# Altium project MediBox.PrjPcb
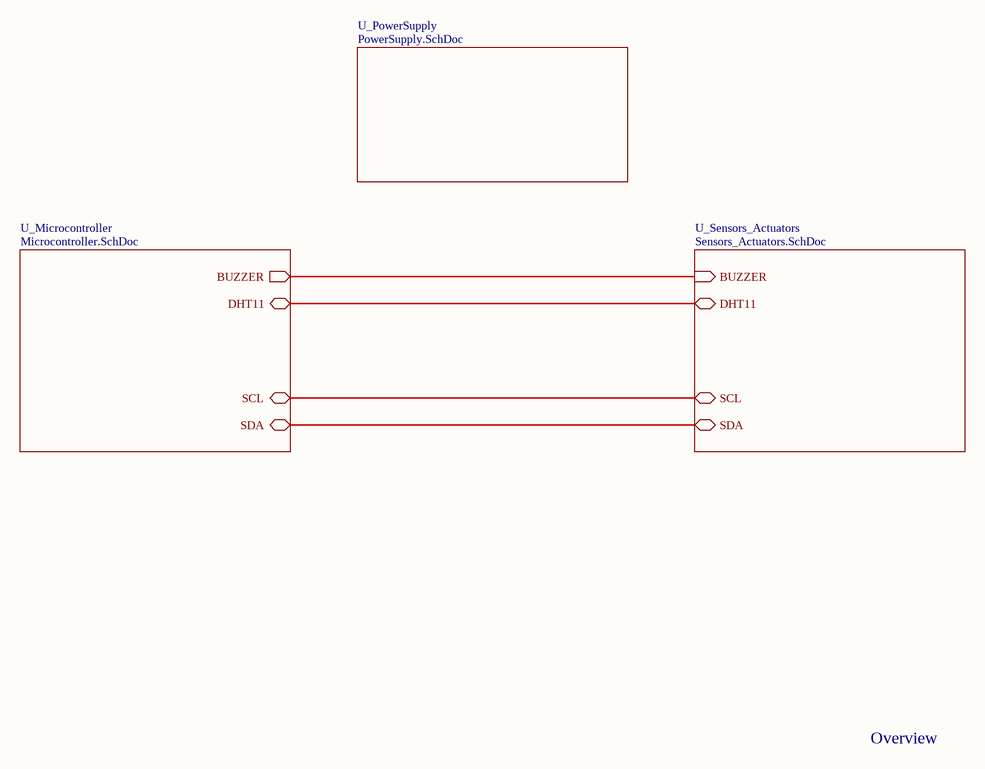
[diagram p0: Overview.SchDoc]
4 sheets, 36 parts. Net scope: hierarchical (ports join the sheet entries above them; power ports are global).
Board file: PCB1.PcbDoc
Sheets:
  Overview.SchDoc
    U_Microcontroller = Microcontroller.SchDoc
    U_PowerSupply = PowerSupply.SchDoc
    U_Sensors_Actuators = Sensors_Actuators.SchDoc

## Sheet Overview.SchDoc
size A4; SheetNumber: 1; SheetTotal: 4

### Sub-sheets
U_Microcontroller = Microcontroller.SchDoc: DHT11 (bidir), BUZZER (out), SDA (bidir), SCL (bidir)
U_PowerSupply = PowerSupply.SchDoc: no entries
U_Sensors_Actuators = Sensors_Actuators.SchDoc: SDA (bidir), DHT11 (bidir), SCL (bidir), BUZZER (in)

### Nets
NetMD1_14: sheet U_Microcontroller/DHT11, sheet U_Sensors_Actuators/DHT11
NetMD1_16: sheet U_Microcontroller/BUZZER, sheet U_Sensors_Actuators/BUZZER
NetMD1_33: sheet U_Microcontroller/SDA, sheet U_Sensors_Actuators/SDA
NetMD1_36: sheet U_Microcontroller/SCL, sheet U_Sensors_Actuators/SCL

### Notes on the sheet
- Overview

## Sheet Microcontroller.SchDoc
size A4; SheetNumber: 3; SheetTotal: 4
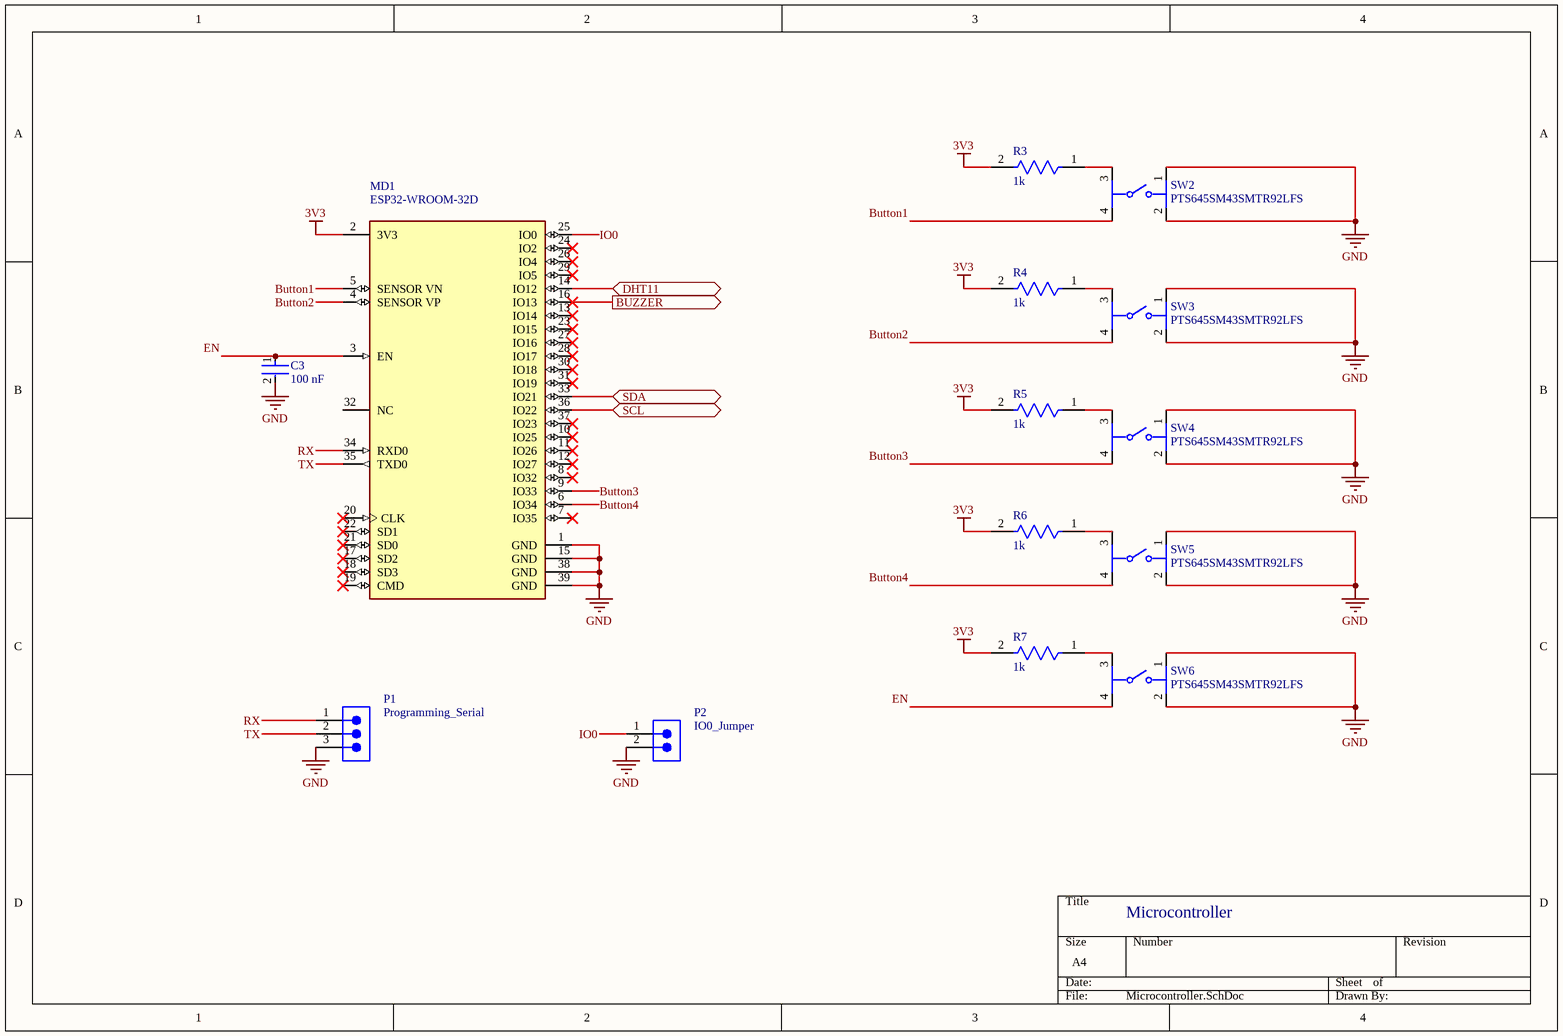
[diagram p1: Microcontroller.SchDoc]

### Parts
C3  100 nF  [FP-CC1206-1_25-MFG]
MD1  ESP32-WROOM-32D  [FP-ESP32-WROOM-32D-MFG]
P1  Programming_Serial  [61900311121]
P2  IO0_Jumper  [61300211121]
R3  1k  [FP-CRCW1206-e3-MFG]
R4  1k  [FP-CRCW1206-e3-MFG]
R5  1k  [FP-CRCW1206-e3-MFG]
R6  1k  [FP-CRCW1206-e3-MFG]
R7  1k  [FP-CRCW1206-e3-MFG]
SW2  PTS645SM43SMTR92LFS  [FP-PTS645SM43SMTR92LFS-MFG]
SW3  PTS645SM43SMTR92LFS  [FP-PTS645SM43SMTR92LFS-MFG]
SW4  PTS645SM43SMTR92LFS  [FP-PTS645SM43SMTR92LFS-MFG]
SW5  PTS645SM43SMTR92LFS  [FP-PTS645SM43SMTR92LFS-MFG]
SW6  PTS645SM43SMTR92LFS  [FP-PTS645SM43SMTR92LFS-MFG]

### Ports
BUZZER (out, see Sensors_Actuators[3B]), DHT11 (bidir, see Sensors_Actuators[1C]), SCL (bidir, see Sensors_Actuators[1B]), SDA (bidir, see Sensors_Actuators[1A])

### Nets
3V3: MD1.2(3V3) R3.2 R4.2 R5.2 R6.2 R7.2
GND: C3.2 MD1.1(GND) MD1.15(GND) MD1.38(GND) MD1.39(GND) P1.3 P2.2 SW2.1 SW2.2 SW3.1 SW3.2 SW4.1 SW4.2 SW5.1 SW5.2 SW6.1 SW6.2
Button1: MD1.5(SENSOR_VN) SW2.4
Button2: MD1.4(SENSOR_VP) SW3.4
Button3: MD1.9(IO33) SW4.4
Button4: MD1.6(IO34) SW5.4
EN: C3.1 MD1.3(EN) SW6.4
IO0: MD1.25(IO0) P2.1
RX: MD1.34(RXD0) P1.1
TX: MD1.35(TXD0) P1.2
NetMD1_14: MD1.14(IO12) ; port DHT11
NetMD1_16: MD1.16(IO13) ; port BUZZER
NetMD1_33: MD1.33(IO21) ; port SDA
NetMD1_36: MD1.36(IO22) ; port SCL
NetR3_1: R3.1 SW2.3
NetR4_1: R4.1 SW3.3
NetR5_1: R5.1 SW4.3
NetR6_1: R6.1 SW5.3
NetR7_1: R7.1 SW6.3

Not connected (* = marked no-connect by the designer): MD1 7(IO35)* 8(IO32)* 10(IO25)* 11(IO26)* 12(IO27)* 13(IO14)* 17(SD2)* 18(SD3)* 19(CMD)* 20(CLK)* 21(SD0)* 22(SD1)* 23(IO15)* 24(IO2)* 26(IO4)* 27(IO16)* 28(IO17)* 29(IO5)* 30(IO18)* 31(IO19)* 32(NC) 37(IO23)*

### Notes on the sheet
- Microcontroller

### Library data of the parts
C3 = CMP-03422-000842-1: CAP CER 0.1UF 50V X7R 1206; Manufacturer: Yageo; Manufacturer Part Number: CC1206KRX7R9BB104; Automotive Grade: NA; Tolerance: 0.1; Material: Ceramic; Temperature Coefficient: 15%; Temperature Characteristic: X7R; Device Class L1: Passive Components; Lead Free: Yes; Octopart: https://octopart.com/cc1206krx7r9bb104-yageo-39467816; Category: Cap; Value: 100 nF; Temperature Range Low: -55°C; Device Class L3: Ceramic Capacitors; Voltage Rating: 50 V; Temperature Range High: +125°C; Device Class L2: Capacitors; RoHS: TRUE; Package: CC1206-1.25; Footprint Url: http://www.yageo.com/exep/pages/download/literatures/UPY-C_GEN_24.pdf; ComponentLink2Description: Datasheet; Temperature: -55°C to +125°C; Capacitance: 100 nF; Digikey Description: CAP CER 0.1UF 50V X7R 1206; Height: 1.45mm; Automotive: No; Mouser Description: Multilayer Ceramic Capacitors MLCC - SMD/SMT 100nF 50V X7R 10%; ComponentLink2URL: http://www.yageo.com/documents/recent/UPY-NP0X7R_HV_1KV-to-3KV_11.pdf
MD1 = CMP-194065-000003-1: WIFI MODULE 32MBITS SPI FLASH; Manufacturer: Espressif Systems; Max Supply Voltage: 3.6V; Nominal Supply Current: 500mA; Max Frequency: 2484MHz; Number Of Adc Channels: 16; Number Of Gpio: 32; Interface: I2C,SPI,UART,Ethernet,I2S,Other; Data Rate: 150Mbits/s; Min Supply Voltage: 3V; Bandwidth: 72MHz; Sensitivity: -98dBm; Octopart: https://octopart.com/esp32-wroom-32d-espressif+systems-91040050; Package: ESP32-WROOM-32D; ComponentLink2URL: https://www.espressif.com/sites/default/files/documentation/esp32-wroom-32d_esp32-wroom-32u_datasheet_en.pdf; Lead Free: Yes; Category: UNK; Mouser Description: Wi-Fi/BT BLE Module ESP32-D0WD, SPI Flash, UART, P; Device Class L1: Integrated Circuits (ICs); RoHS: TRUE; Temperature Range Low: -40°C; ComponentLink2Description: Datasheet; Digikey Description: WIFI MODULE 32MBITS SPI FLASH; Height: 3.2mm; Temperature: -40°C to +85°C; Manufacturer Part Number: ESP32-WROOM-32D; Device Class L3: Transceivers; Device Class L2: RF Semiconductors and Devices; Temperature Range High: +85°C; Automotive: No
P1 = CMP-1502-00585-2: NexarPartId: 18818222; Current Rating: 3A; Voltage Rating: 250V; Number of Positions: 3; Insulation Resistance: 1GΩ; Gender: Male; Pitch: 2.54mm; Connector Type: Male Pin; Contact Resistance: 20mΩ; Termination: Through Hole; Width: 7.66mm; Contact Plating: Tin; Orientation: Vertical; Mount: Through Hole; Contact Gender: Male; Max Operating Temperature: 105°C; Length: 7.62mm; Number of Rows: 1; Height: 12.5mm; Lead Pitch: 2.54mm; Housing Material: Nylon; Color: Beige; Contact Material: Copper; Fastening Type: Friction; Min Operating Temperature: -40°C; Number of Contacts: 3; Number of Pins: 3; Flammability Rating: UL94 V-0; Contact Mating Length: 7.493mm; RoHS: Compliant; REACH SVHC: Unknown; Packaging: Bulk; Operating Supply Voltage: 250V
P2 = CMP-1712-00002-6: NexarPartId: 20081794; Number of Contacts: 2; Pitch: 2.54mm; Connector Type: Male Pin; Voltage Rating: 250V; Current Rating: 3A; Gender: Male; Contact Resistance: 20mΩ; Height: 8.94mm; Lead Free: Lead Free; Number of Pins: 2; Termination: Through Hole; RoHS: Compliant; Lead Pitch: 2.54mm; REACH SVHC: No SVHC; Housing Material: PBT; Contact Mating Length: 5.9944mm; Min Operating Temperature: -40°C; Orientation: Vertical; Contact Material: Copper; Contact Gender: Male; Max Operating Temperature: 125°C; Number of Rows: 1; Number of Positions: 2; Packaging: Bulk; Contact Plating: Gold; Mount: Through Hole; Color: Black; Operating Supply Voltage: 250V
R3-R7 = CMP-2003-01876-2: RES Thick Film, 1.2kΩ, 1%, 0.25W, 100ppm/°C, 1206; Voltage Rating (DC): 200V; Power Rating: 250mW; Resistance: 1.2kR; Temperature Coefficient: 100ppm/°C; Features: Automotive AEC-Q200; Lead Free: Lead Free; Termination: SMD/SMT; Composition: Thick Film; Length: 3.2mm; Width: 0.063inch; Case Code (Imperial): 1206; Contact Plating: Tin; Number of Terminations: 2; Height: 0.55mm; Depth: 1.6mm; Max Operating Temperature: 155°C; Tolerance: 1%; Case/Package: 1206; Voltage Rating: 200V; Case Code (Metric): 3216; Packaging: Tape and Reel; Weight: 0.000353oz; Package Quantity: 10; Max Power Dissipation: 250mW; Min Operating Temperature: -55°C; Working Voltage: 200V; Radiation Hardening: No; Military Standard: Not
SW2-SW6 = CMP-2000-05160-2: SWITCH TACTILE SPST-NO 0.05A 12V; Contact Resistance: 100mR; Throw Configuration: SPST; Illumination Type: Non-Illuminated; Mechanical Life: 100000Cycles; Current Rating: 50mA; Switch Function: Off-Mom; Actuator Length: 0.85mm; Actuator Material: Nylon; Actuator Type: Standard; Operating Force: 160gf; Min Operating Temperature: -20°C; REACH SVHC: No SVHC; Termination: Gull Wing; Case/Package: SMD/SMT; Packaging: Tape and Reel; Mount: Surface Mount; Voltage Rating (DC): 12V; Orientation: Straight; Lead Free: Lead Free; Contact Material: Silver; Color: Black; Max Current Rating: 50mA; Contact Plating: Silver; Depth: 9mm; Package Quantity: 1; Max Voltage Rating (DC): 12V; Length: 6mm; Max Operating Temperature: 60°C

## Sheet PowerSupply.SchDoc
size A4; SheetNumber: 2; SheetTotal: 4
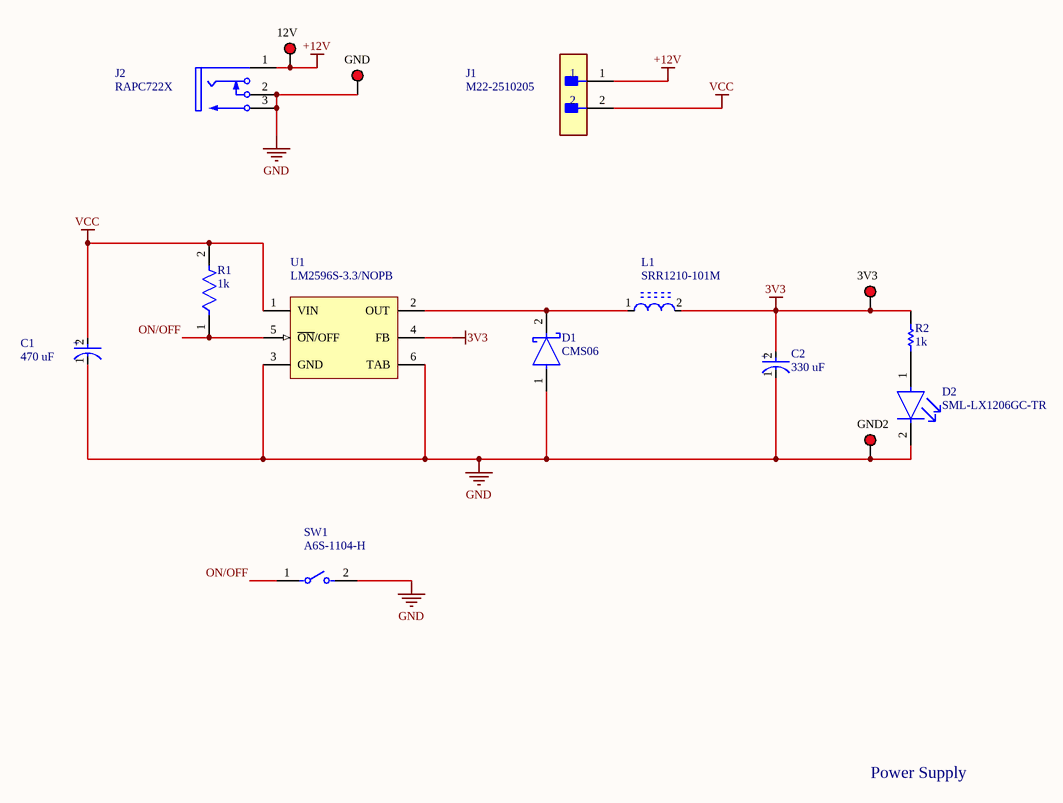
[diagram p2: PowerSupply.SchDoc]

### Parts
3V3  5010  [KSTN-5010_V]  (value not drawn)
12V  5010  [KSTN-5010_V]  (value not drawn)
C1  470 uF  [FP-FKF-MFG]
C2  330 uF  [FP-FKG-MFG]
D1  CMS06  [FP-M-FLAT-MFG]
D2  SML-LX1206GC-TR  [FP-SML-LX1206GC-TR-MFG]
GND  5010  [KSTN-5010_V]  (value not drawn)
GND2  5010  [KSTN-5010_V]  (value not drawn)
J1  M22-2510205  [FP-M22-2510205-MFG]
J2  RAPC722X  [SWITCH-RAPC712X-3_V]
L1  SRR1210-101M  [FP-SRR1210-MFG]
R1  1k  [FP-CRCW1206-e3-MFG]
R2  1k  [RESC3216X70X50ML20T25]
SW1  A6S-1104-H  [FP-A6S-1104-H-MFG]
U1  LM2596S-3.3/NOPB  [KTT0005B_M]

### Nets
3V3: 3V3.1 C2.2(A) L1.2 R2.2 U1.4(FB)
+12V: 12V.1 J1.1 J2.1
GND: C1.1(C) C2.1(C) D1.1(A) D2.2(C) GND.1 GND2.1 J2.2 J2.3 SW1.2 U1.3(GND) U1.6(TAB)
VCC: C1.2(A) J1.2 R1.2 U1.1(VIN)
ON/OFF: R1.1 SW1.1 U1.5(~{ON}/OFF)
NetD1_2: D1.2(C) L1.1 U1.2(OUT)
NetD2_1: D2.1(A) R2.1

### Notes on the sheet
- Power Supply
- (in symbol CMP-2000-06208-3) +
- (in symbol CMP-05427-002115-1) +

### Library data of the parts
3V3 12V GND GND2 = CMP-1672-00002-4: Test Point, Red, Through Hole, RoHS, Bulk; Manufacturer: Keystone; Contact Material: Bronze; Mounting Technology: Through Hole; RoHSCompliant: true; Pins: 1; Package Quantity: 100; ComponentLink2Description: Datasheet; Height: 8.12 mm; ComponentLink1URL: http://www.keyelco.com/; DatasheetVersion: Rev. F, 12/2013; Mount: Through Hole; PackageReference: 5010; Contact Plating: Silver; Packaging: Bulk; Colour: Red; REACH SVHC: No SVHC; PackageDescription: 1-Pin Through Hole Device, Dia 3.17 mm; ComponentLink2URL: http://www.keyelco.com/product-pdf.cfm?p=1319; ComponentLink1Description: Manufacturer URL
C1 = CMP-2000-06208-3: CAP ALUM 100UF 20% 50V SMD; Leakage Current: 3uA; ESR (Equivalent Series Resistance): 340mR; Material: Aluminium; Ripple Current: 350mA; Life (Hours): 2000Hour; Min Operating Temperature: -55°C; Contact Plating: Tin; REACH SVHC: No SVHC; RoHS Compliant: Yes; Width: 10mm; Radiation Hardening: No; Termination: SMD/SMT; Packaging: Tape and Reel; Max Operating Temperature: 105°C; Case/Package: Radial; Voltage Rating: 50V; Length: 10.2mm; Voltage: 50V; Package Quantity: 1; Voltage Rating (DC): 50V; Height - Seated (Max): 0.402inch; Mount: Surface Mount; Impedance: 340mR; Construction: Cylindrical; Height: 10.2mm; Lead Free: Lead Free; Dielectric Material: Aluminium; Series: FK; Tolerance: 20%; Diameter: 8mm; Ripple Current (AC): 350mA; Capacitance: 100uF; Number of Pins: 2
C2 = CMP-05427-002115-1: CAP ALUM 330UF 20% 35V SMD; ESR (Equivalent Series Resistance): 80mR; Ripple Current: 850mA; Dielectric Material: Aluminium; Lead Length: 3.5mm; Life (Hours): 2000Hour; Leakage Current: 115.5uA; Length: 10.2mm; Construction: Cylindrical; Package Quantity: 500; Termination: SMD/SMT; RoHS Compliant: Yes; Impedance: 80mR; Width: 10.3mm; Height - Seated (Max): 0.402inch; Voltage: 35V; Voltage Rating: 35V; Diameter: 10mm; Contact Plating: Tin; Number of Pins: 2; Capacitance: 330uF; Case/Package: Radial; Reach SVHC Compliant: Yes; Lead Free: Lead Free; Series: FK; Ripple Current (AC): 850mA; Tolerance: 20%; Ratings: AEC-Q200; Lead Pitch: 4.6mm; Mount: Surface Mount; Height: 10.2mm; Max Operating Temperature: 105°C; Packaging: Tape and Reel; Min Operating Temperature: -55°C; Voltage Rating (DC): 35V; Radiation Hardening: No
D1 = CMP-2000-06115-2: DIODE SCHOTTKY 30V 2A MFLAT; Forward Voltage: 370mV; Peak Non-Repetitive Surge Current: 40A; Max Reverse Leakage Current: 3mA; Element Configuration: Single; Package Quantity: 1; Max Operating Temperature: 125°C; Mount: Surface Mount; Max Repetitive Reverse Voltage (Vrrm): 30V; Forward Current: 2A; Number of Pins: 2; Min Operating Temperature: -40°C; Radiation Hardening: No; Average Rectified Current: 2A; Contact Plating: Tin; Max Reverse Voltage (DC): 30V; Peak Reverse Current: 3mA; Max Surge Current: 40A; Packaging: Tape and Reel
D2 = CMP-2000-07122-2: LED GREEN CLEAR 1206 SMD; Test Current: 20mA; Luminous Intensity: 10mcd; Forward Voltage: 2.2V; Viewing Angle: 160°; Lens Color: Colorless; Approvals: UL; Dominant Wavelength: 565nm; Current Rating: 25mA; Number of LEDs: 1; Power Rating: 65mW; Lens Style: Rectangular; Length: 3.2mm; Mount: Surface Mount; Package Quantity: 1; Forward Current: 20mA; Case/Package: 1206; Lead Free: Lead Free; Case Code (Imperial): 1206; Max Operating Temperature: 85°C; REACH SVHC: No SVHC; RoHS Compliant: Yes; Number of Pins: 2; Illumination Color: Green; Width: 1.6mm; Packaging: Tape and Reel; Wavelength: 565nm; Lens Transparency: Clear; Height: 1.1mm; Color: Green; Min Operating Temperature: -40°C; Case Code (Metric): 3216
J1 = CMP-15831-000005-1: CONN HEADER VERT 2POS 2MM; Manufacturer: Harwin; Conn Gender: Male; Current Rating: 2A; Number Of Contacts: 2; Conn Orientation: Vertical; Temperature Range Low: -40°C; Device Class L1: Connectors; ComponentLink2URL: https://cdn.harwin.com/pdfs/C018XX_M22_Series_Connectors.pdf; Temperature Range High: +105°C; Pitch: 2mm; Number Of Rows: 1; Temperature: -40°C to +105°C; Automotive: No; Device Class L3: unset; Octopart: https://octopart.com/m22-2510205-harwin-2538221; Mouser Description: Headers & Wire Housings 2 PIN SIL VERTICAL GOLD PIN HEADER; Height: 5.45mm; Category: Conn; Digikey Description: CONN HEADER VERT 2POS 2MM; Contact Material: Gold,Nickel; Lead Free: Yes; ComponentLink2Description: Datasheet; Manufacturer Part Number: M22-2510205; Device Class L2: Headers and Wire Housings; Package: 0; Footprint Url: https://cdn.harwin.com/pdfs/M22-251.pdf; RoHS: TRUE
J2 = CMP-2000-05384-1: Power Jack, 5 A, 3-Pin THD, RoHS, Bulk; Manufacturer: Switchcraft; Current Rating: 5A; Plug/Mating Plug Diameter: 2.1mmID,5.5mmOD; Gender: Male; Mating Products: S765-ND / -CONNPLUGMINIPWR2CONDWHT/RED / S760K-ND / -CONNPOWERPLUGMINI.08"BLACK / SC1052-ND / -CONNPOWERPLUGMINIBLACK; Number of Positions/Contacts: 2Conductors,2Contacts; Internal Switch(s): SingleSwitch,NormallyClosed; Shielding: Unshielded; Catalog Drawings: RAPC7(1,2)2XSide / RAPC7(1,2)2XTop; Dynamic Catalog: SwitchcraftInc; Other Names: Q2287470A / RAPC722X-ND / SC1313; Standard Package: 2,500; Termination: SolderEyelet(s); Family: Barrel-PowerConnectors; Housing Color: Black; Housing Material: Thermoplastic; RoHS Information: SwitchcraftRoHSInfo; Color: Black; Contact Material - Plating: Nickel; Mounting Type: ThroughHole,RightAngle; Manufacturer URL: http://www.switchcraft.com/; Contact Material: Brass; Datasheet Version: Rev. A, 08/2005; Connector Type: Jack; Category: Connectors,Interconnects; Datasheet URL: http://www.mouser.com/ds/2/393/rapc722x_cd-371352.pdf
L1 = CMP-07248-000065-1: FIXED IND 100UH 2.5A 135MOHM SMD; Shielding: Shielded; DC Resistance (DCR): 135mR; Core Material: Ferrite; Inductance Tolerance: 20%; Saturation Current: 2.2A; Q Factor: 16; Self Resonant Frequency: 3MHz; Test Frequency: 100kHz; Height: 10mm; Width: 0.472inch; Mount: Surface Mount; Inductance: 100uH; RMS Current (Irms): 2.5A; Packaging: Tape and Reel; Max Operating Temperature: 125°C; Military Standard: Not; DC Current: 2.5A; Max DC Current: 2.5A; Length: 12mm; RoHS Compliant: Yes; Height - Seated (Max): 0.394inch; Resistor Type: Wirewound; Current Rating: 2.5A; REACH SVHC: No SVHC; Tolerance: 20%; Series: SRR1210; Package Quantity: 1; Min Operating Temperature: -40°C; Depth: 12.5mm; Case/Package: 1210; Termination: SMD/SMT
R1 = CMP-2003-01876-2: as R3 on sheet Microcontroller; Temperature Coefficient: 100ppm/°C; Features: Automotive AEC-Q200; Lead Free: Lead Free; Termination: SMD/SMT; Composition: Thick Film; Length: 3.2mm; Width: 0.063inch; Case Code (Imperial): 1206; Contact Plating: Tin; Number of Terminations: 2; Height: 0.55mm; Depth: 1.6mm; Max Operating Temperature: 155°C; Tolerance: 1%; Case/Package: 1206; Voltage Rating: 200V; Case Code (Metric): 3216; Packaging: Tape and Reel; Weight: 0.000353oz; Package Quantity: 10; Max Power Dissipation: 250mW; Min Operating Temperature: -55°C; Working Voltage: 200V; Radiation Hardening: No; Military Standard: Not
R2 = CMP-2003-04435-1: Part Number: ERA8AEB202V; Manufacturer: Panasonic
SW1 = CMP-08827-000005-1: SWITCH SLIDE DIP SPST 25MA 24V; Manufacturer: Omron Electronics Inc-EMC Div; Throw Configuration: SPST-NO; Standoff Height: 0mm; Number Of Circuits: 1; Electromechanical Life: 1000Cycles; Contact Resistance: 200mΩ; Digikey Description: SWITCH SLIDE DIP SPST 25MA 24V; ComponentLink2Description: Datasheet; Mount: Surface Mount; Manufacturer Part Number: A6S-1104-H; ComponentLink2URL: https://omronfs.omron.com/en_US/ecb/products/pdf/en-a6s.pdf; Category: Switch; Height: 3.95mm; Device Class L3: DIP Switches; Octopart: https://octopart.com/a6s-1104-h-omron-55410938; Mouser Description: DIP Switches / SIP Switches Dip Switch; Lead Free: Yes; Temperature Range Low: -20°C; Temperature Range High: +70°C; Automotive: No; Ambient Temperature Range Low: -20°C; Ambient Temperature Range High: +70°C; Voltage Rating Dc: 24V; Device Class L2: Switches; RoHS: TRUE; Package: 0; Contact Current Rating: 25mA; Device Class L1: Electromechanical; Temperature: -20°C to +70°C
U1 = CMP-0069-00275-3: SIMPLE SWITCHER® Power Converter 150 KHz 3A Step-Down Voltage Regulator, 5-pin TO-263, Pb-Free; Manufacturer: Texas Instruments; PackageTopMarking: NSUZXYTTE#*LM2596S*-3.3 P+; PowerWise: N; RoHS: Y; PackageReference: KTT0005B; PackageDescription: TO-263, Molded, .400 x .390 x .180in, 5 Lead, .067in Pitch, Surface Mount; PinCount: 5; ComponentLink1Description: Datasheet URL; Code_JEDEC: MO-169-AB; ComponentLink1URL: http://www.ti.com/general/docs/lit/getliterature.tsp?genericPartNumber=LM2596&fileType=pdf; CompType: Switcher

## Sheet Sensors_Actuators.SchDoc
size A4; SheetNumber: 3; SheetTotal: 3
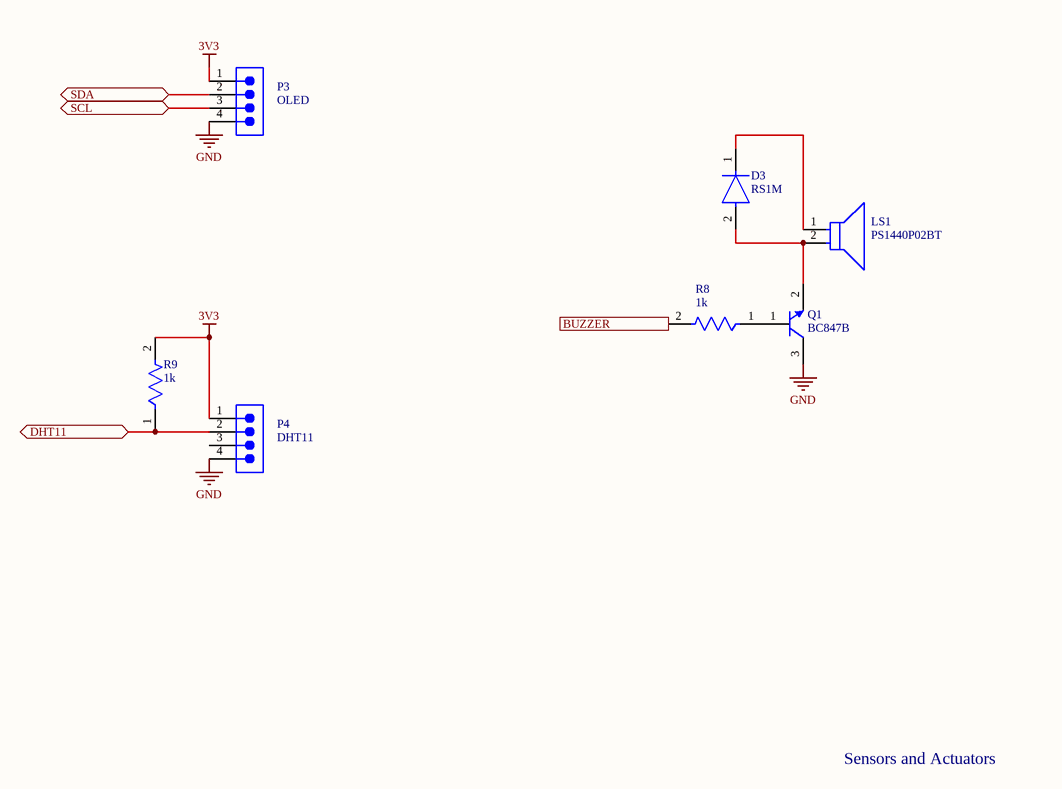
[diagram p3: Sensors_Actuators.SchDoc]

### Parts
D3  RS1M  [FP-403AE-MFG]
LS1  PS1440P02BT  [FP-PS1440P02BT-MFG]
P3  OLED  [61300411121]
P4  DHT11  [61300411121]
Q1  BC847B  [INF-SOT23_M]
R8  1k  [FP-CRCW1206-e3-MFG]
R9  1k  [FP-CRCW1206-e3-MFG]

### Ports
BUZZER (in, see Microcontroller[2B]), DHT11 (bidir, see Microcontroller[2B]), SCL (bidir, see Microcontroller[2B]), SDA (bidir, see Microcontroller[2B])

### Nets
3V3: P3.1 P4.1 R9.2
GND: P3.4 P4.4 Q1.3(C)
NetD3_1: D3.1(C) LS1.1
NetD3_2: D3.2(A) LS1.2 Q1.2(E)
NetMD1_14: P4.2 R9.1 ; port DHT11
NetMD1_16: R8.2 ; port BUZZER
NetMD1_33: P3.2 ; port SDA
NetMD1_36: P3.3 ; port SCL
NetQ1_1: Q1.1(B) R8.1

Not connected (* = marked no-connect by the designer): P4 3

### Notes on the sheet
- Sensors and Actuators

### Library data of the parts
D3 = CMP-07163-000022-1: DIODE GEN PURP 1KV 1A SMA; Manufacturer: ON Semiconductor; Max Surge Forward Current: 30A; Max Repetitive Reverse Voltage: 1000V; Value: 10pF; Max Junction Temp: +150°C; Peak Reverse Current: 5uA; Standoff Height: 0.05mm; ComponentLink2URL: https://www.onsemi.com/pub/Collateral/RS1M-D.PDF; Footprint Url: https://www.onsemi.com/pub/Collateral/403AE.PDF; Mouser Description: On a Reel of 7500, ON Semi 1000V 1A, Diode, 2-Pin DO-214AC RS1M; Package: 403AE; Manufacturer Part Number: RS1M; Temperature Range Low: -55°C; Device Class L1: Discrete Semiconductors; Automotive: No; Height: 2.5mm; Octopart: https://octopart.com/rs1m-on+semiconductor-84331238; Digikey Description: DIODE GEN PURP 1KV 1A SMA; Temperature Range High: +150°C; Capacitance: 10pF; RoHS: TRUE; Device Class L2: Diodes; ComponentLink2Description: Datasheet; Temperature: -55°C to +150°C; Device Class L3: Rectifier Diodes; Forward Current: 1A; Lead Free: Yes; Category: Diode
LS1 = CMP-08413-000003-1: AUDIO PIEZO TRANSDUCER 30V TH; Self Resonant Frequency: 4kHz; Washable: No; Voltage Rating (DC): 3V; Number of Terminals/Pins: 2; Packaging: Tape and Reel; Lead Free: Lead Free; Min Operating Temperature: -10°C; Package Quantity: 350; Termination: PC Pins; Mount: Through Hole; Max Operating Temperature: 70°C; Operating Supply Voltage: 3V; Diameter: 14mm; RoHS Compliant: Yes; Frequency: 4kHz; Height: 8mm
P3 P4 = CMP-1502-01064-3: NexarPartId: 32855522; Operating Supply Voltage: 250V; Pitch: 2.54mm; Contact Resistance: 20mΩ; Number of Positions: 4; Current Rating: 3A; Connector Type: Male Pin; Gender: Male; Contact Plating: Gold; Height: 8.89mm; Lead Pitch: 2.54mm; Lead Free: Lead Free; Contact Mating Length: 5.9944mm; Number of Rows: 1; Termination: Solder; Packaging: Bulk; REACH SVHC: Unknown; Min Operating Temperature: -40°C; RoHS: Compliant; Number of Contacts: 4; Voltage Rating: 250V; Color: Black; Max Operating Temperature: 105°C; Contact Material: Copper; Mount: Through Hole; Orientation: Vertical; Number of Pins: 4
Q1 = CMP-1177-00042-1: NPN Silicon AF Transistor, 45 V VCEO, 100 mA IC, SOT23, Reel, Green; Manufacturer: Infineon; VEBO (max): 6Â V; ICBO (max): 15Â nA; VCBO (max): 50Â V; IBM (max): 200Â mA; Green: TRUE; Ptot (max): 330Â mW; fT (typ): 250Â MHz; IC (max): 100Â mA; VCEO (max): 45Â V; PackageDescription: 3-Pin Small Outline Transistor Package, 1.3 x 2.9 mm Body, 0.95 mm Pitch; ComponentLink3URL: http://www.infineon.com/dgdl/SOT23-Package_Overview.pdf?folderId=db3a30431936bc4b0119532290053c66&fileId=db3a30431936bc4b0119533468123c85; PackageVersion: Apr-08; Packing: Reel; ComponentLink3Description: Package Specification; ComponentLink2URL: http://www.infineon.com/dgdl/bc847series_bc848series_bc849series_bc850series.pdf?folderId=db3a304314dca389011541d30fa21656&fileId=db3a304314dca389011541d4630a1657; ComponentLink1URL: http://www.infineon.com/; ComponentLink2Description: Datasheet; Polarity: NPN; Mounting Technology: Surface Mount; PackageReference: SOT23; ICM (max): 200Â mA; ComponentLink1Description: Manufacturer URL; PartNumber: BC847B
R8 R9 = CMP-2003-01876-2: as R3 on sheet Microcontroller; Temperature Coefficient: 100ppm/°C; Features: Automotive AEC-Q200; Lead Free: Lead Free; Termination: SMD/SMT; Composition: Thick Film; Length: 3.2mm; Width: 0.063inch; Case Code (Imperial): 1206; Contact Plating: Tin; Number of Terminations: 2; Height: 0.55mm; Depth: 1.6mm; Max Operating Temperature: 155°C; Tolerance: 1%; Case/Package: 1206; Voltage Rating: 200V; Case Code (Metric): 3216; Packaging: Tape and Reel; Weight: 0.000353oz; Package Quantity: 10; Max Power Dissipation: 250mW; Min Operating Temperature: -55°C; Working Voltage: 200V; Radiation Hardening: No; Military Standard: Not

## Nets that join several sheets
3V3: Microcontroller (6 pins), PowerSupply (5 pins), Sensors_Actuators (P3.1 P4.1 R9.2)
GND: Microcontroller (17 pins), PowerSupply (11 pins), Sensors_Actuators (P3.4 P4.4 Q1.3)
NetMD1_14: Microcontroller (MD1.14), Sensors_Actuators (P4.2 R9.1)
NetMD1_16: Microcontroller (MD1.16), Sensors_Actuators (R8.2)
NetMD1_33: Microcontroller (MD1.33), Sensors_Actuators (P3.2)
NetMD1_36: Microcontroller (MD1.36), Sensors_Actuators (P3.3)